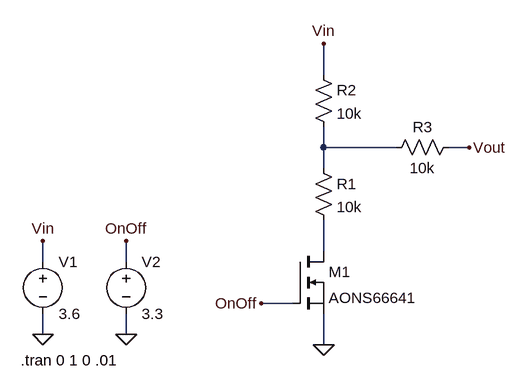
[diagram p0: schematic Draft2.asc]
Draft2.asc, the LTspice schematic file:
Version 4
SHEET 1 880 680
WIRE 192 -208 192 -256
WIRE 192 -96 192 -128
WIRE 304 -96 192 -96
WIRE 416 -96 384 -96
WIRE 192 -64 192 -96
WIRE 192 64 192 16
WIRE -240 80 -240 48
WIRE -112 80 -112 48
WIRE 144 144 96 144
WIRE -240 192 -240 160
WIRE -112 192 -112 160
WIRE 192 208 192 160
FLAG -240 192 0
FLAG -240 48 Vin
FLAG -112 192 0
FLAG -112 48 OnOff
FLAG 96 144 OnOff
FLAG 192 208 0
FLAG 192 -256 Vin
FLAG 416 -96 Vout
SYMBOL voltage -240 64 R0
SYMATTR InstName V1
SYMATTR Value 3.6
SYMBOL nmos 144 64 R0
SYMATTR InstName M1
SYMATTR Value AONS66641
SYMBOL voltage -112 64 R0
WINDOW 123 0 0 Left 0
WINDOW 39 0 0 Left 0
SYMATTR InstName V2
SYMATTR Value 3.3
SYMBOL res 176 -80 R0
SYMATTR InstName R1
SYMATTR Value 10k
SYMBOL res 176 -224 R0
SYMATTR InstName R2
SYMATTR Value 10k
SYMBOL res 400 -112 R90
WINDOW 0 0 56 VBottom 2
WINDOW 3 32 56 VTop 2
SYMATTR InstName R3
SYMATTR Value 10k
TEXT -274 232 Left 2 !.tran 0 1 0 .01

The netlist it stands for:
* Draft2.asc
V1 Vin 0 3.6
M1 N002 OnOff 0 0 AONS66641
V2 OnOff 0 3.3
R1 N001 N002 10k
R2 Vin N001 10k
R3 Vout N001 10k
.model NMOS NMOS
.model PMOS PMOS
.lib standard.mos
.tran 0 1 0 .01
.backanno
.end